# Altium schematic sheet wrist_sch.SchDoc
size A; SheetNumber: 1; SheetTotal: 2
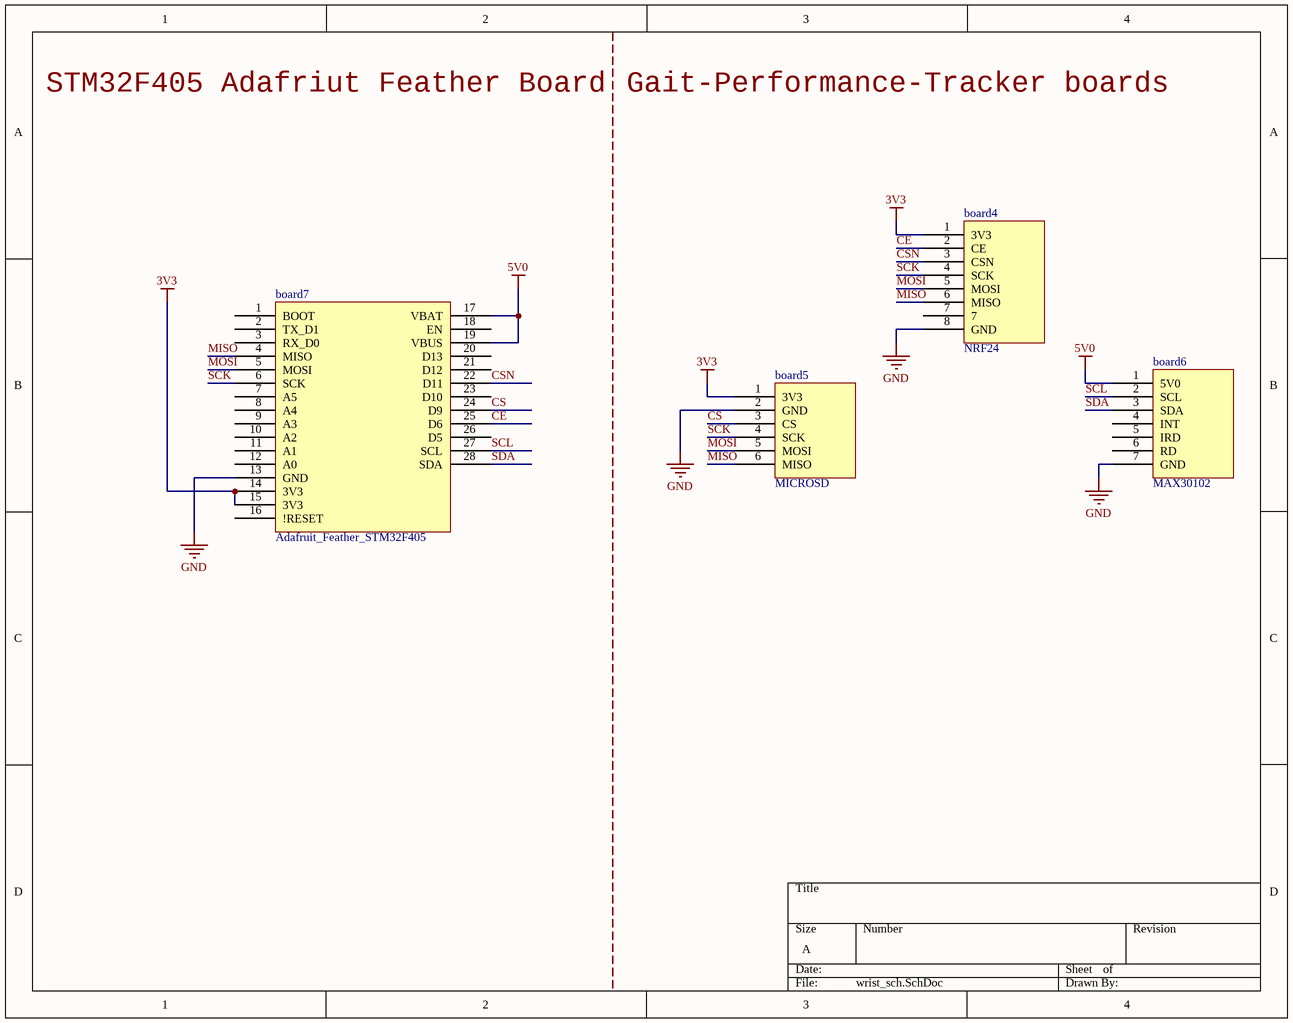
[diagram p0: wrist_sch.SchDoc]

## Parts
board4  NRF24  [nrf24]
board5  MICROSD  [Model Name]
board6  MAX30102  [max30102]
board7  Adafruit_Feather_STM32F405  [Adafruit_Feather_STM32F405]

## Nets
3V3: board4.1(3V3) board5.1(3V3) board7.14(3V3) board7.15(3V3)
5V0: board6.1(5V0) board7.17(VBAT) board7.19(VBUS)
GND: board4.8(GND) board5.2(GND) board6.7(GND) board7.13(GND)
CE: board4.2(CE) board7.25(D6)
CS: board5.3(CS) board7.24(D9)
CSN: board4.3(CSN) board7.22(D11)
MISO: board4.6(MISO) board5.6(MISO) board7.4(MISO)
MOSI: board4.5(MOSI) board5.5(MOSI) board7.5(MOSI)
SCK: board4.4(SCK) board5.4(SCK) board7.6(SCK)
SCL: board6.2(SCL) board7.27(SCL)
SDA: board6.3(SDA) board7.28(SDA)

Not connected (* = marked no-connect by the designer): board4 7; board6 4(INT) 5(IRD) 6(RD); board7 1(BOOT) 2(TX_D1) 3(RX_D0) 7(A5) 8(A4) 9(A3) 10(A2) 11(A1) 12(A0) 16(!RESET) 18(EN) 20(D13) 21(D12) 23(D10) 26(D5)

## Notes on the sheet
- STM32F405 Adafriut Feather Board
- Gait-Performance-Tracker boards